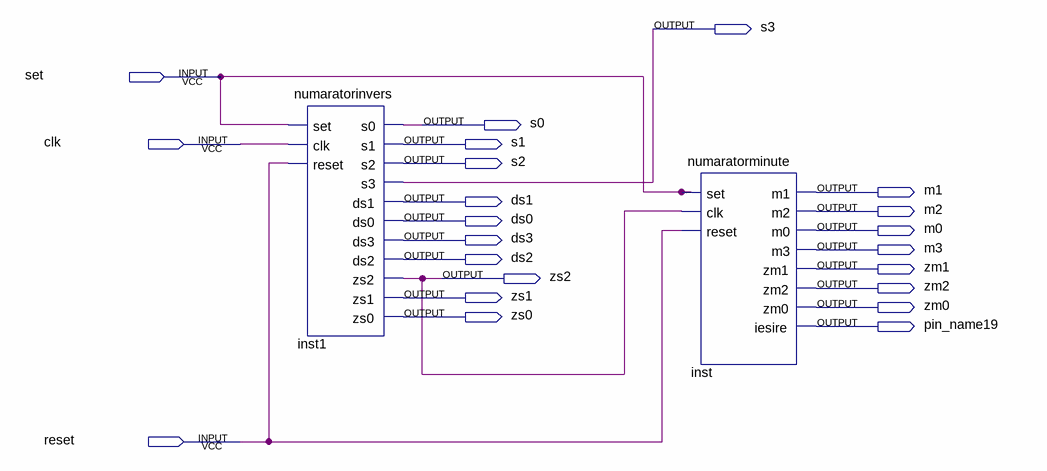
[diagram p0: schematic sheet]
// Quartus schematic numfinal.bdf as structural Verilog: 2 symbols, 22 pins
module numfinal (
  input  set,
  input  clk,
  input  reset,
  output s3,
  output s0,
  output s1,
  output s2,
  output m1,
  output ds1,
  output m2,
  output ds0,
  output m0,
  output ds3,
  output m3,
  output ds2,
  output zm1,
  output zs2,
  output zm2,
  output zs1,
  output zm0,
  output zs0,
  output pin_name19
);

  numaratorinvers inst1 (
    .set(set), .clk(clk), .reset(reset), .s0(s0), .s1(s1), .s2(s2), .s3(s3), .ds1(ds1), .ds0(ds0), .ds3(ds3),
    .ds2(ds2), .zs2(zs2), .zs1(zs1), .zs0(zs0));
  numaratorminute inst (
    .set(set), .clk(zs2), .reset(reset), .m1(m1), .m2(m2), .m0(m0), .m3(m3), .zm1(zm1), .zm2(zm2), .zm0(zm0),
    .iesire(pin_name19));
endmodule
